# Altium schematic sheet eMMC - SD card.SchDoc: eMMC - SD card
size A3; Author: Vi Tín; SheetNumber: 6; SheetTotal: 15
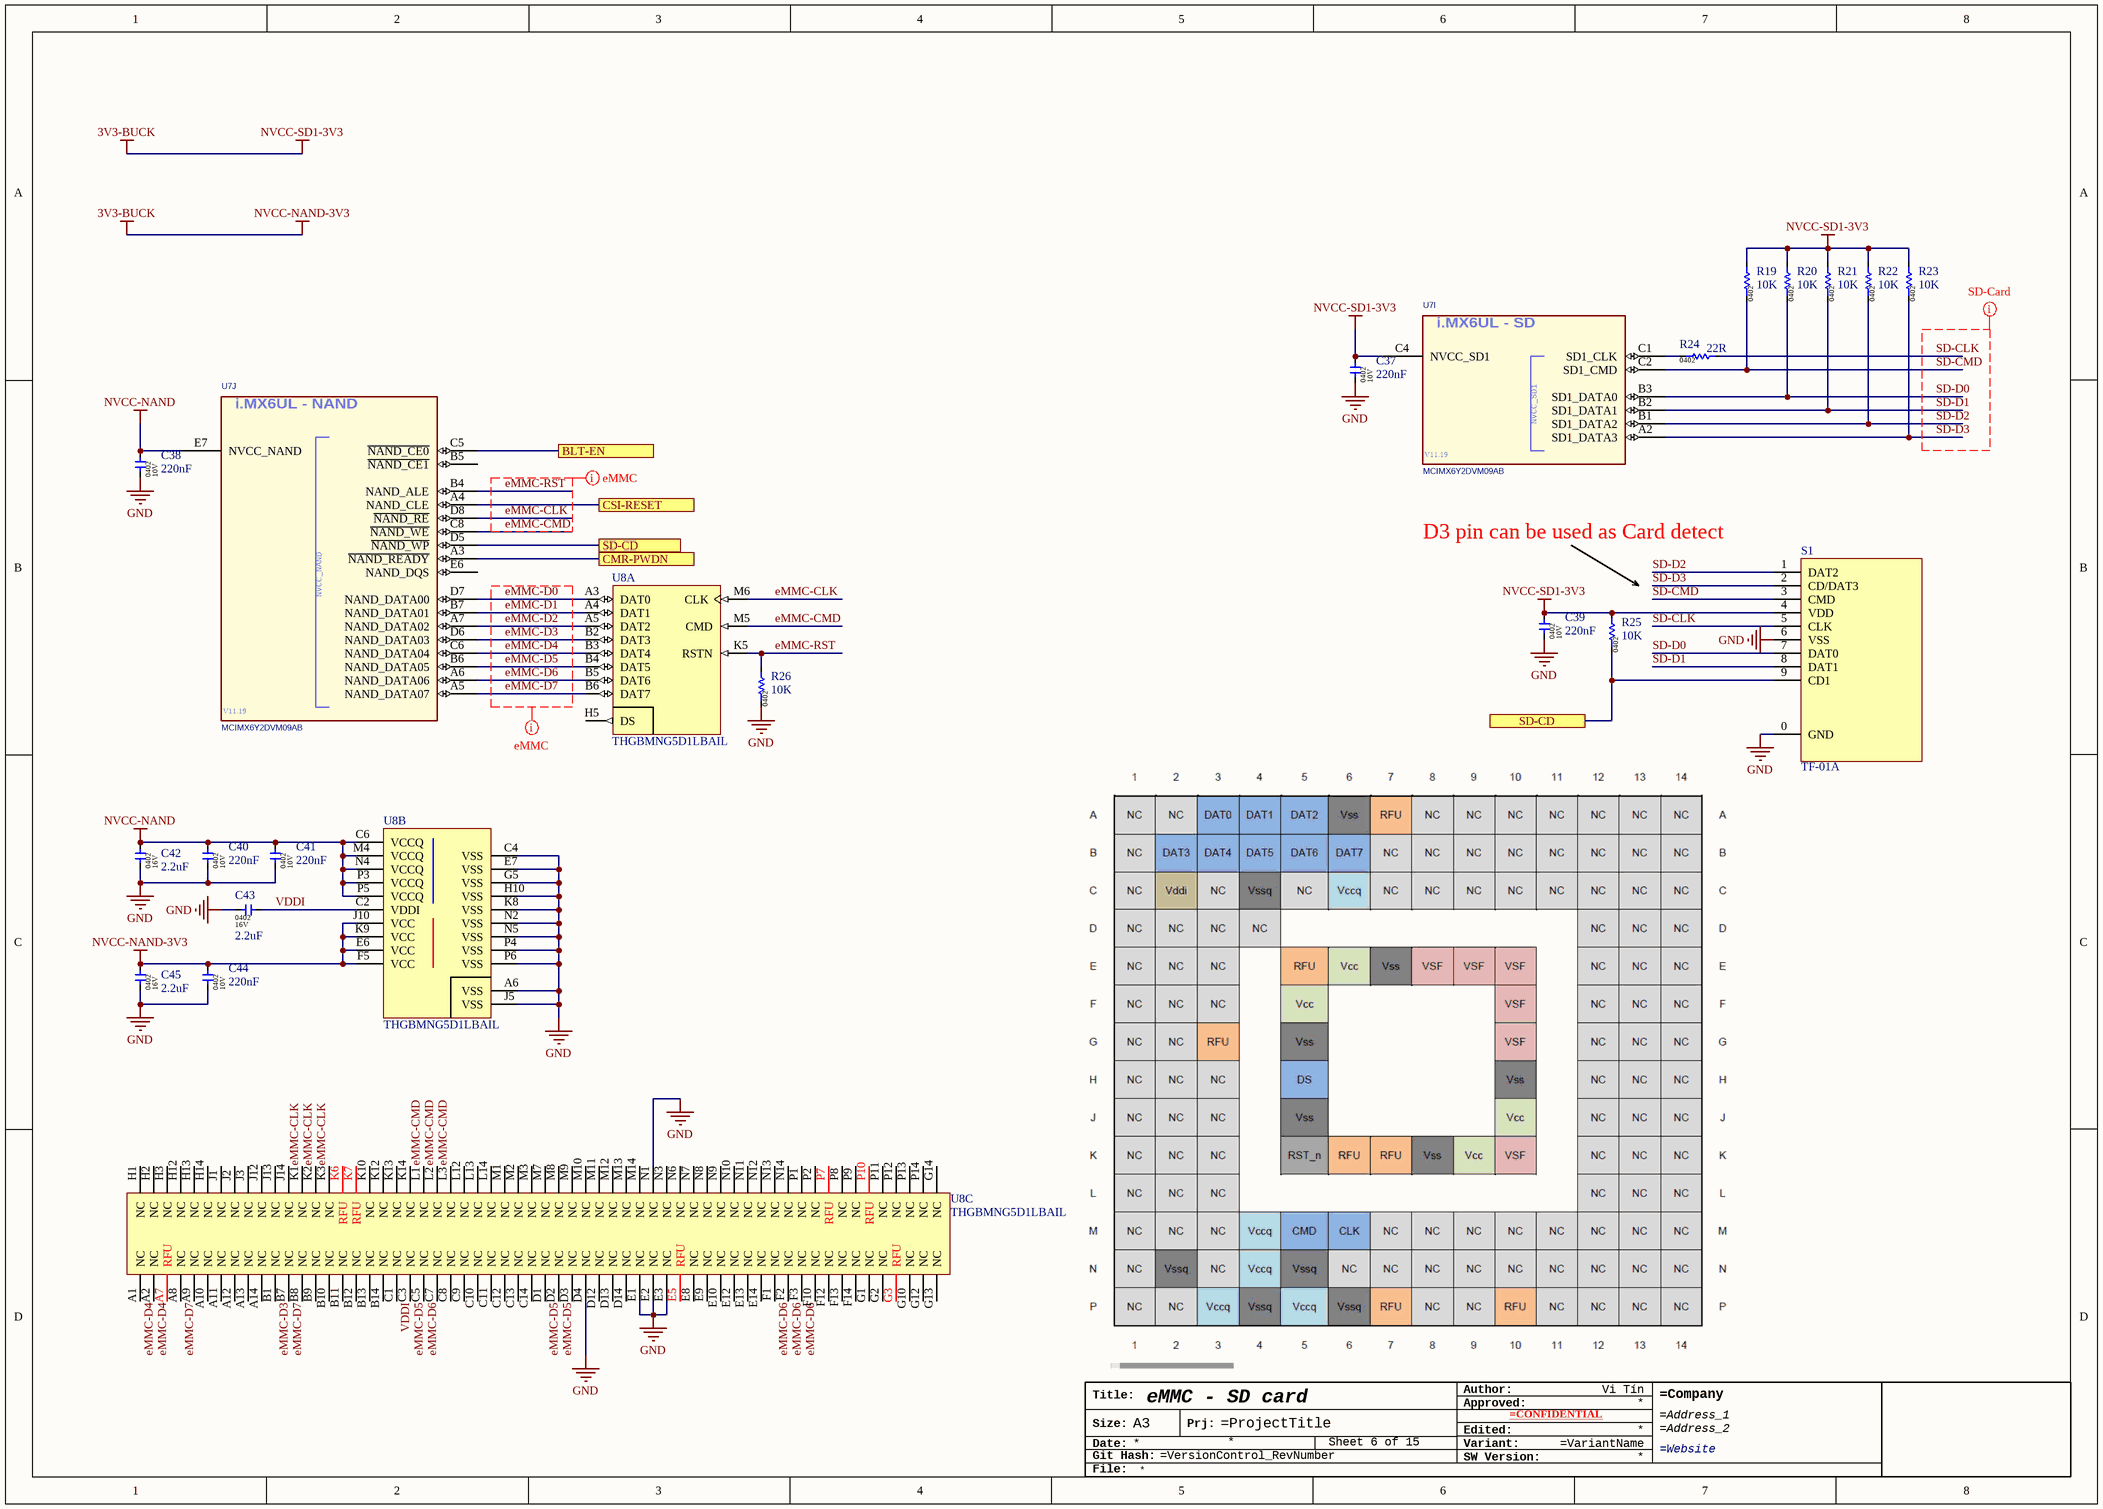
[diagram p0: eMMC - SD card.SchDoc]

## Parts
*?  TitleBlock_Generic  (value not drawn)  (graphical)
C37  220nF  [CAP-0402]
C38  220nF  [CAP-0402]
C39  220nF  [CAP-0402]
C40  220nF  [CAP-0402]
C41  220nF  [CAP-0402]
C42  2.2uF  [CAP-0402]
C43  2.2uF  [CAP-0402]
C44  220nF  [CAP-0402]
C45  2.2uF  [CAP-0402]
R19  10K  [RES-0402]
R20  10K  [RES-0402]
R21  10K  [RES-0402]
R22  10K  [RES-0402]
R23  10K  [RES-0402]
R24  22R  [RES-0402]
R25  10K  [RES-0402]
R26  10K  [RES-0402]
S1  TF-01A  [micro SDCARD]
U7  MCIMX6Y2DVM09AB  [IMX6ULL]  (parts I,J of 11)
U8  THGBMNG5D1LBAIL  [eMMC - 153 pin]  (parts A,B,C of 3)

## Ports
BLT-EN, CMR-PWDN, CSI-RESET, SD-CD

## Nets
3V3-BUCK: C37.2 C39.2 C44.2 C45.2 R19.2 R20.2 R21.2 R22.2 R23.2 R25.2 S1.4(VDD) U7.C4(NVCC_SD1) U8.E6(VCC) U8.F5(VCC) U8.J10(VCC) U8.K9(VCC)  [also labelled NVCC-NAND-3V3, NVCC-SD1-3V3]
GND: C37.1 C38.1 C39.1 C40.1 C41.1 C42.1 C43.1 C44.1 C45.1 R26.1 S1.0(GND) S1.6(VSS) U8.A6(VSS) U8.C4(VSS) U8.D4(NC) U8.E1(NC) U8.E2(NC) U8.E3(NC) U8.E7(VSS) U8.G5(VSS) U8.H10(VSS) U8.J5(VSS) U8.K8(VSS) U8.N1(NC) U8.N2(VSS) U8.N5(VSS) U8.P4(VSS) U8.P6(VSS)
NVCC-NAND: C38.2 C40.2 C41.2 C42.2 U7.E7(NVCC_NAND) U8.C6(VCCQ) U8.M4(VCCQ) U8.N4(VCCQ) U8.P3(VCCQ) U8.P5(VCCQ)
BLT-EN: U7.C5(~{NAND_CE0}) ; port BLT-EN
CMR-PWDN: U7.A3(~{NAND_READY}) ; port CMR-PWDN
CSI-RESET: U7.A4(NAND_CLE) ; port CSI-RESET
eMMC-CLK: U7.D8(~{NAND_RE}) U8.K1(NC) U8.K2(NC) U8.K3(NC) U8.M6(CLK)
eMMC-CMD: U7.C8(~{NAND_WE}) U8.L1(NC) U8.L2(NC) U8.L3(NC) U8.M5(CMD)
eMMC-D0: U7.D7(NAND_DATA00) U8.A3(DAT0)
eMMC-D1: U7.B7(NAND_DATA01) U8.A4(DAT1)
eMMC-D2: U7.A7(NAND_DATA02) U8.A5(DAT2)
eMMC-D3: U7.D6(NAND_DATA03) U8.B1(NC) U8.B2(DAT3)
eMMC-D4: U7.C6(NAND_DATA04) U8.A1(NC) U8.A2(NC) U8.B3(DAT4)
eMMC-D5: U7.B6(NAND_DATA05) U8.B4(DAT5) U8.C3(NC) U8.D1(NC) U8.D2(NC)
eMMC-D6: U7.A6(NAND_DATA06) U8.B5(DAT6) U8.C5(NC) U8.F1(NC) U8.F2(NC) U8.F3(NC)
eMMC-D7: U7.A5(NAND_DATA07) U8.A8(NC) U8.B6(DAT7) U8.B7(NC)
eMMC-RST: R26.2 U7.B4(NAND_ALE) U8.K5(RSTN)
SD-CD: R25.1 S1.9(CD1) U7.D5(~{NAND_WP}) ; port SD-CD
SD-CLK: R24.2 S1.5(CLK)
SD-CMD: R19.1 S1.3(CMD) U7.C2(SD1_CMD)
SD-D0: R20.1 S1.7(DAT0) U7.B3(SD1_DATA0)
SD-D1: R21.1 S1.8(DAT1) U7.B2(SD1_DATA1)
SD-D2: R22.1 S1.1(DAT2) U7.B1(SD1_DATA2)
SD-D3: R23.1 S1.2(CD/DAT3) U7.A2(SD1_DATA3)
VDDI: C43.2 U8.C1(NC) U8.C2(VDDI)
NetR24_1: R24.1 U7.C1(SD1_CLK)

Not connected (* = marked no-connect by the designer): U7 B5(~{NAND_CE1}) E6(NAND_DQS); U8 A7(RFU) A9(NC) A10(NC) A11(NC) A12(NC) A13(NC) A14(NC) B8(NC) B9(NC) B10(NC) B11(NC) B12(NC) B13(NC) B14(NC) C7(NC) C8(NC) C9(NC) C10(NC) C11(NC) C12(NC) C13(NC) C14(NC) D3(NC) D12(NC) D13(NC) D14(NC) E5(RFU) E8(NC) E9(NC) E10(NC) E12(NC) E13(NC) E14(NC) F10(NC) F12(NC) F13(NC) F14(NC) G1(NC) G2(NC) G3(RFU) G10(NC) G12(NC) G13(NC) G14(NC) H1(NC) H2(NC) H3(NC) H5(DS) H12(NC) H13(NC) H14(NC) J1(NC) J2(NC) J3(NC) J12(NC) J13(NC) J14(NC) K6(RFU) K7(RFU) K10(NC) K12(NC) K13(NC) K14(NC) L12(NC) L13(NC) L14(NC) M1(NC) M2(NC) M3(NC) M7(NC) M8(NC) M9(NC) M10(NC) M11(NC) M12(NC) M13(NC) M14(NC) N3(NC) N6(NC) N7(NC) N8(NC) N9(NC) N10(NC) N11(NC) N12(NC) N13(NC) N14(NC) P1(NC) P2(NC) P7(RFU) P8(NC) P9(NC) P10(RFU) P11(NC) P12(NC) P13(NC) P14(NC)

## Layout directives
mark named SD-Card: SD-CLK, SD-CMD, SD-D0, SD-D1, SD-D2, SD-D3
net class eMMC: eMMC-CLK, eMMC-CMD, eMMC-D0, eMMC-D1, eMMC-D2, eMMC-D3, eMMC-D4, eMMC-D5, eMMC-D6, eMMC-D7, eMMC-RST

## Notes on the sheet
- (near S1) D3 pin can be used as Card detect
- (in symbol MCIMX6Y2DVM09AB, part I) i.MX6UL - SD; V11.19
- (in symbol MCIMX6Y2DVM09AB, part J) i.MX6UL - NAND; V11.19
- (in symbol TitleBlock_Generic) Author:; Title:; Approved:; Size:; A3; Prj:; Edited:; Date:; Variant:; SW Version:; Git Hash:; File:

## Library data of the parts
C37-C41 C44 = 0402X224J100CT: 220nF ±5% 10V X5R 0402 Multilayer Ceramic Capacitors MLCC - SMD/SMT RoHS; Manufacture: WALSIN; Package / Case: 0402; Component type: Capacitor; Manufacture part: 0402X224J100CT; Capacitor value: 220nF; Voltage: 10V; Package: 0402
C42 C43 C45 = EMK105ABJ225KV-F: X5R 2.2uF ±10% 16V 0402 Multilayer Ceramic Capacitors MLCC - SMD/SMT ROHS; Manufacture: Taiyo Yuden; Package / Case: 0402; Component type: Capacitor; Manufacture part: EMK105ABJ225KV-F; Capacitor value: 2.2uF; Voltage: 16V; Package: 0402
R19-R23 R25 R26 = WR04X1002FTL: 10kΩ ±1% 1/16W ±100ppm/℃ 0402 Chip Resistor - Surface Mount RoHS; Manufacture: WALSIN; Package / Case: 0201; Component type: Resistor; Manufacture part: WR04X1002FTL; Resistor value: 10K; Package: 0402
R24 = WR04X22R0FTL: 22Ω ±1% 1/16W ±100ppm/℃ 0402 Chip Resistor - Surface Mount RoHS; Manufacture: WALSIN; Package / Case: 0201; Component type: Resistor; Manufacture part: WR04X22R0FTL; Resistor value: 22R; Package: 0402
S1 = TF-01A: microSD Memory Card 8 connector&Ejector SMD Card Sockets Connectors RoHS; Manufacture: Korean Hroparts Elec; Manufacture part: TF-01A; Type: SDCARD; Datasheet: https://datasheet.lcsc.com/lcsc/2105061832_XUNPU-TF-115_C266620.pdf
U7 = MCIMX6Y2DVM09AB: Microprocessors - MPU i.MX 32-bit MPU ARM -A7 900MHz, 0.8mm Pitch; Manufacture: NXP Semiconductors; CLASS: IC; CAD_APPROVED: Yes; PRE_APN: 330-76997; MFG_PN01: PCIMX6G3CVM05AA; MFG_NAME01: FREESCALE SEMICONDUCTOR; AGILE_PN: TMP-WF-23753; HEIGHT: 1.37 MM; ROHS: Yes; Manufacture part: MCIMX6Y2DVM09AB; Package: MAPBGA-289 (14x14); Datasheet: https://www.mouser.vn/datasheet/2/302/IMX6ULLCEC-1126331.pdf
U8 = THGBMNG5D1LBAIL: eMMC 5.0 4GB, 11.50x13.0mm; Manufacture: Kioxia America; Package Description: 153-Pin Fine Pitch Ball Grid Array, Body 13 x 11.5 mm, Pitch 0.5 mm; Package Reference: FBGA-153; Manufacture part: THGBMNG5D1LBAIL; Package: FBGA-153; Datasheet: https://www.mouser.vn/datasheet/2/1034/KIOXIA_Consumer_Grade_e_MMC-1951726.pdf
*? = TitleBlock_Generic: Manufacture part: TitleBlock_Generic; Manufacture: N/A; Type: Graphic